# Altium schematic sheet ESP32.SchDoc
size A3; DrawnBy: Orhun Dabak; SheetNumber: 5; SheetTotal: 7
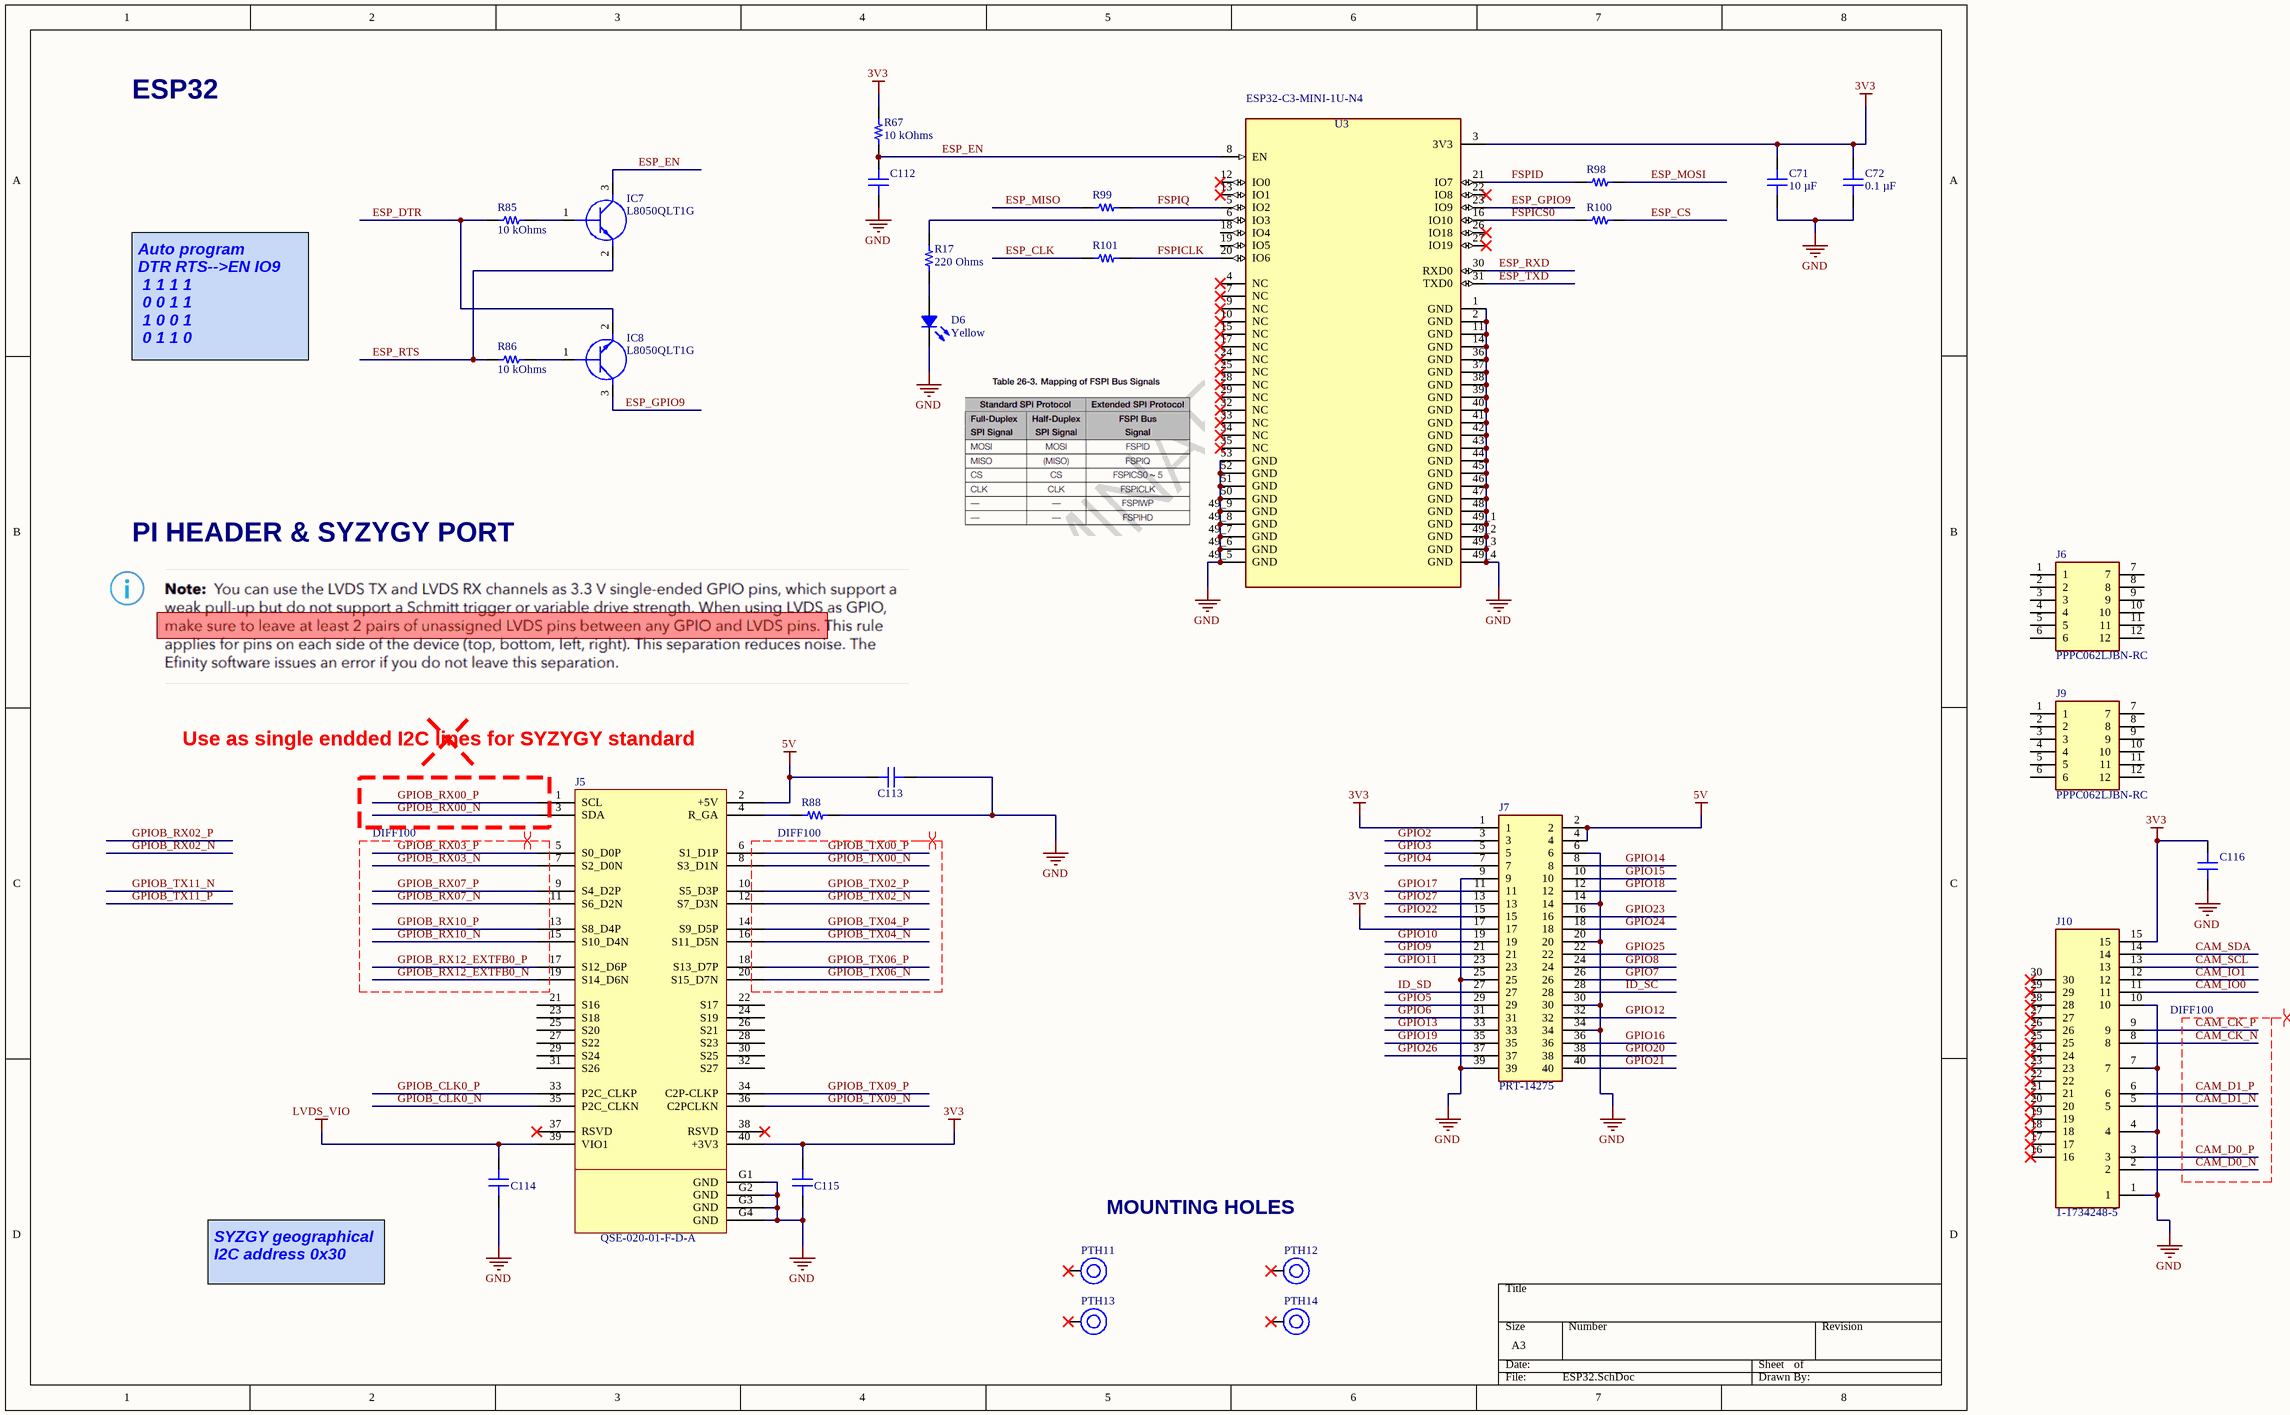
[diagram p0: ESP32.SchDoc]

## Parts
C71  10 µF  [CAP 0603_1608]
C72  0.1 µF  [CAP 0603_1608]
C112  1 µF  [CAP 0402_1005]  (value not drawn)
C113  0.1 µF  [CAP 0402_1005]  (value not drawn)
C114  0.1 µF  [CAP 0402_1005]  (value not drawn)
C115  0.1 µF  [CAP 0402_1005]  (value not drawn)
C116  0.1 µF  [CAP 0402_1005]  (value not drawn)
D6  Yellow  [LED 0603_1608 YELLOW]
IC7  L8050QLT1G  [L8050QLT1G]
IC8  L8050QLT1G  [L8050QLT1G]
J5  QSE-020-01-F-D-A  [QSE-020-01-F-D-A-Footprint-2]
J6  PPPC062LJBN-RC  [RHDRRA12W60P254X254_2X6_1574X850X508P]
J7  PRT-14275  [HDRV40W64P254_2X20_5080X500X884P]
J9  PPPC062LJBN-RC  [RHDRRA12W60P254X254_2X6_1574X850X508P]
J10  1-1734248-5  [117342485]
PTH11  SYZYGY_PCB_Mounting_Hole  [SYZYGY_PCB_Mounting_Hole]  (value not drawn)  (no BOM)
PTH12  SYZYGY_PCB_Mounting_Hole  [SYZYGY_PCB_Mounting_Hole]  (value not drawn)  (no BOM)
PTH13  SYZYGY_PCB_Mounting_Hole  [SYZYGY_PCB_Mounting_Hole]  (value not drawn)  (no BOM)
PTH14  SYZYGY_PCB_Mounting_Hole  [SYZYGY_PCB_Mounting_Hole]  (value not drawn)  (no BOM)
R17  220 Ohms  [RES 0402_1005]
R67  10 kOhms  [RES 0402_1005]
R85  10 kOhms  [RES 0402_1005]
R86  10 kOhms  [RES 0402_1005]
R88  210 kOhms  [RES 0402_1005]  (value not drawn)
R98  33 Ohms  [RES 0402_1005]  (value not drawn)
R99  33 Ohms  [RES 0402_1005]  (value not drawn)
R100  33 Ohms  [RES 0402_1005]  (value not drawn)
R101  33 Ohms  [RES 0402_1005]  (value not drawn)
U3  ESP32-C3-MINI-1U-N4  [XCVR_ESP32-C3-MINI-1U-N4]

## Nets
3V3: C71.2 C72.2 C115.1 C116.2 J5.40(+3V3) J7.1 J7.17 J10.15 R67.2 U3.3(3V3)
5V: C113.2 J5.2(+5V) J7.2 J7.4
GND: C71.1 C72.1 C112.1 C113.1 C114.2 C115.2 C116.1 D6.2 J5.G1(GND) J5.G2(GND) J5.G3(GND) J5.G4(GND) J7.6 J7.9 J7.14 J7.20 J7.25 J7.30 J7.34 J7.39 J10.1 J10.4 J10.7 J10.10 R88.2 U3.1(GND) U3.2(GND) U3.11(GND) U3.14(GND) U3.36(GND) U3.37(GND) U3.38(GND) U3.39(GND) U3.40(GND) U3.41(GND) U3.42(GND) U3.43(GND) U3.44(GND) U3.45(GND) U3.46(GND) U3.47(GND) U3.48(GND) U3.49_1(GND) U3.49_2(GND) U3.49_3(GND) U3.49_4(GND) U3.49_5(GND) U3.49_6(GND) U3.49_7(GND) U3.49_8(GND) U3.49_9(GND) U3.50(GND) U3.51(GND) U3.52(GND) U3.53(GND)
LVDS_VIO: C114.1 J5.39(VIO1)
CAM_CK_N: J10.8
CAM_CK_P: J10.9
CAM_D0_N: J10.2
CAM_D0_P: J10.3
CAM_D1_N: J10.5
CAM_D1_P: J10.6
CAM_IO0: J10.11
CAM_IO1: J10.12
CAM_SCL: J10.13
CAM_SDA: J10.14
ESP_CLK: R101.1
ESP_CS: R100.2
ESP_DTR: IC8.2(E) R85.2
ESP_EN: C112.2 IC7.3(C) R67.1 U3.8(EN)
ESP_GPIO9: IC8.3(C) U3.23(IO9)
ESP_MISO: R99.1
ESP_MOSI: R98.2
ESP_RTS: IC7.2(E) R86.2
ESP_RXD: U3.30(RXD0)
ESP_TXD: U3.31(TXD0)
FSPICLK: R101.2 U3.20(IO6)
FSPICS0: R100.1 U3.16(IO10)
FSPID: R98.1 U3.21(IO7)
FSPIQ: R99.2 U3.5(IO2)
GPIO2: J7.3
GPIO3: J7.5
GPIO4: J7.7
GPIO5: J7.29
GPIO6: J7.31
GPIO7: J7.26
GPIO8: J7.24
GPIO9: J7.21
GPIO10: J7.19
GPIO11: J7.23
GPIO12: J7.32
GPIO13: J7.33
GPIO14: J7.8
GPIO15: J7.10
GPIO16: J7.36
GPIO17: J7.11
GPIO18: J7.12
GPIO19: J7.35
GPIO20: J7.38
GPIO21: J7.40
GPIO22: J7.15
GPIO23: J7.16
GPIO24: J7.18
GPIO25: J7.22
GPIO26: J7.37
GPIO27: J7.13
GPIOB_CLK0_N: J5.35(P2C_CLKN)
GPIOB_CLK0_P: J5.33(P2C_CLKP)
GPIOB_RX00_N: J5.3(SDA)
GPIOB_RX00_P: J5.1(SCL)
GPIOB_RX03_N: J5.7(S2_D0N)
GPIOB_RX03_P: J5.5(S0_D0P)
GPIOB_RX07_N: J5.11(S6_D2N)
GPIOB_RX07_P: J5.9(S4_D2P)
GPIOB_RX10_N: J5.15(S10_D4N)
GPIOB_RX10_P: J5.13(S8_D4P)
GPIOB_RX12_EXTFB0_N: J5.19(S14_D6N)
GPIOB_RX12_EXTFB0_P: J5.17(S12_D6P)
GPIOB_TX00_N: J5.8(S3_D1N)
GPIOB_TX00_P: J5.6(S1_D1P)
GPIOB_TX02_N: J5.12(S7_D3N)
GPIOB_TX02_P: J5.10(S5_D3P)
GPIOB_TX04_N: J5.16(S11_D5N)
GPIOB_TX04_P: J5.14(S9_D5P)
GPIOB_TX06_N: J5.20(S15_D7N)
GPIOB_TX06_P: J5.18(S13_D7P)
GPIOB_TX09_N: J5.36(C2PCLKN)
GPIOB_TX09_P: J5.34(C2P-CLKP)
ID_SC: J7.28
ID_SD: J7.27
NetD6_1: D6.1 R17.2
NetIC7_1: IC7.1(B) R85.1
NetIC8_1: IC8.1(B) R86.1
NetJ5_4: J5.4(R_GA) R88.1
NetR17_1: R17.1 U3.6(IO3)

Not connected (* = marked no-connect by the designer): J5 21(S16) 22(S17) 23(S18) 24(S19) 25(S20) 26(S21) 27(S22) 28(S23) 29(S24) 30(S25) 31(S26) 32(S27) 37(RSVD)* 38(RSVD)*; J6 1 2 3 4 5 6 7 8 9 10 11 12; J9 1 2 3 4 5 6 7 8 9 10 11 12; J10 16* 17* 18* 19* 20* 21* 22* 23* 24* 25* 26* 27* 28* 29* 30*; PTH11 1*; PTH12 1*; PTH13 1*; PTH14 1*; U3 4(NC)* 7(NC)* 9(NC)* 10(NC)* 12(IO0)* 13(IO1)* 15(NC)* 17(NC)* 18(IO4) 19(IO5) 22(IO8)* 24(NC)* 25(NC)* 26(IO18)* 27(IO19)* 28(NC)* 29(NC)* 32(NC)* 33(NC)* 34(NC)* 35(NC)*

## Layout directives
differential pair; differential pair class DIFF100: CAM_CK_N, CAM_CK_P, CAM_D0_N, CAM_D0_P, CAM_D1_N, CAM_D1_P, GPIOB_RX03_N, GPIOB_RX03_P, GPIOB_RX07_N, GPIOB_RX07_P, GPIOB_RX10_N, GPIOB_RX10_P, GPIOB_RX12_EXTFB0_N, GPIOB_RX12_EXTFB0_P, GPIOB_TX00_N, GPIOB_TX00_P, GPIOB_TX02_N, GPIOB_TX02_P, GPIOB_TX04_N, GPIOB_TX04_P, GPIOB_TX06_N, GPIOB_TX06_P

## Notes on the sheet
- ESP32
- Auto program
  DTR RTS-->EN IO9
  1 1 1 1
  0 0 1 1
  1 0 0 1
  0 1 1 0
- PI HEADER & SYZYGY PORT
- Use as single endded I2C lines for SYZYGY standard
- MOUNTING HOLES
- SYZGY geographical I2C address 0x30

## Library data of the parts
C71 = GRM188R60J106ME47D: CAP CER 10UF 6.3V X5R 0603; manufacturer: Murata Electronics; Tolerance: ±20%; Part Number: GRM188R60J106ME47D; Value: 10 µF; Applications: General Purpose; Capacitance: 10 µF; componentlink1description: Datasheet; componentlink1url: https://www.murata.com/~/media/webrenewal/support/library/catalog/products/capacitor/mlcc/c02e.ashx?la=en-us; componentlink2description: DigiKey Link; componentlink2url: https://www.digikey.com/en/products/detail/murata-electronics/GRM188R60J106ME47D/965910; Device Package: 0603 (1608 Metric); lastupdated: 9/19/2022 01:01:20 PM; Lifecycle Status: Active; Minimum Order: 1; Mounting Type: Surface Mount, MLCC; Operating Temperature: -55°C ~ 85°C; Package / Case: 0603 (1608 Metric); packaging: TapeAndReel; partid: 2351; Part Status: Active; price: 0.02; series: GRM; Size / Dimension: 0.063" L x 0.031" W (1.60mm x 0.80mm); Supplier 1: DigiKey; Supplier Part Number 1: 490-3896-1-ND; Temperature Coefficient: X5R; Thickness (Max): 0.035" (0.90mm); Voltage - Rated: 6.3V
C72 = 6R3X14W104MV4T: CAP CER 0.1UF 6.3V X7R 0603; manufacturer: Johanson Dielectrics Inc.; Tolerance: ±20%; Part Number: 6R3X14W104MV4T; Value: 0.1 µF; Applications: Bypass, Decoupling; Capacitance: 0.1 µF; componentlink1description: Datasheet; componentlink1url: https://www.johansondielectrics.com/downloads/x2y-filter-and-decoupling-capacitors.pdf; componentlink2description: DigiKey Link; componentlink2url: https://www.digikey.com/en/products/detail/johanson-dielectrics-inc/6R3X14W104MV4T/1556331; Device Package: 0603 (1608 Metric); Features: Low ESL (X2Y); lastupdated: 9/19/2022 01:01:19 PM; Lifecycle Status: Active; Minimum Order: 1; Mounting Type: Surface Mount, MLCC; Operating Temperature: -55°C ~ 125°C; Package / Case: 0603 (1608 Metric); packaging: TapeAndReel; partid: 2650; Part Status: Active; price: 0.08; series: X2Y®; Size / Dimension: 0.064" L x 0.035" W (1.63mm x 0.89mm); Supplier 1: DigiKey; Supplier Part Number 1: 709-1009-1-ND; Temperature Coefficient: X7R; Thickness (Max): 0.026" (0.66mm); Voltage - Rated: 6.3V
C112 = GRM155R70J105KA12J: CAP CER 1UF 6.3V X7R 0402; manufacturer: Murata Electronics; Tolerance: ±10%; Part Number: GRM155R70J105KA12J; Value: 1 µF; Applications: General Purpose; Capacitance: 1 µF; componentlink1description: Datasheet; componentlink1url: https://search.murata.co.jp/Ceramy/image/img/A01X/G101/ENG/GRM155R70J105KA12-01.pdf; componentlink2description: DigiKey Link; componentlink2url: https://www.digikey.com/en/products/detail/murata-electronics/GRM155R70J105KA12J/4905166; Device Package: 0402 (1005 Metric); lastupdated: 19/09/2022 12:57:31; Lifecycle Status: Active; Minimum Order: 1; Mounting Type: Surface Mount, MLCC; Operating Temperature: -55°C ~ 125°C; Package / Case: 0402 (1005 Metric); packaging: TapeAndReel; partid: 2890; Part Status: Active; price: 0.01; series: GRM; Size / Dimension: 0.039" L x 0.020" W (1.00mm x 0.50mm); Supplier 1: DigiKey; Supplier Part Number 1: 490-13339-1-ND; Temperature Coefficient: X7R; Thickness (Max): 0.022" (0.55mm); Voltage - Rated: 6.3V
C113-C116 = CC0402KRX7R6BB104: CAP CER 0.1UF 10V X7R 0402; manufacturer: Yageo; Tolerance: ±10%; Part Number: CC0402KRX7R6BB104; Value: 0.1 µF; Applications: General Purpose; Capacitance: 0.1 µF; componentlink1description: Datasheet; componentlink1url: https://www.yageo.com/upload/media/product/productsearch/datasheet/mlcc/UPY-GPHC_X7R_6.3V-to-50V_18.pdf; componentlink2description: DigiKey Link; componentlink2url: https://www.digikey.com/en/products/detail/yageo/CC0402KRX7R6BB104/2103083; Device Package: 0402 (1005 Metric); lastupdated: 19/09/2022 12:57:28; Lifecycle Status: Active; Minimum Order: 1; Mounting Type: Surface Mount, MLCC; Operating Temperature: -55°C ~ 125°C; Package / Case: 0402 (1005 Metric); packaging: CutTape; partid: 3877; Part Status: Active; price: 0.01; series: CC; Size / Dimension: 0.039" L x 0.020" W (1.00mm x 0.50mm); Supplier 1: DigiKey; Supplier Part Number 1: 311-1345-1-ND; Temperature Coefficient: X7R; Thickness (Max): 0.022" (0.55mm); Voltage - Rated: 10V
D6 = SML-LX0603YW-TR: LED YELLOW DIFFUSED SMD; Manufacturer: Lumex Opto/Components Inc.; Configuration: Standard; Current - Test: 20mA; Lens Color: White; Lens Size: 1.00mm x 0.80mm; Lens Style: Rectangle with Flat Top; Millicandela Rating: 14mcd; Viewing Angle: 160°; Voltage - Forward (Vf) (Typ): 2.1V; Wavelength - Peak: 585nm; Part Number: SML-LX0603YW-TR; Color: Yellow; ComponentLink1Description: Datasheet; ComponentLink1URL: https://www.lumex.com/content/files/ProductAttachment/SML-LX0603YW-TR.pdf; ComponentLink2Description: DigiKey Link; ComponentLink2URL: https://www.digikey.com/en/products/detail/lumex-opto-components-inc/SML-LX0603YW-TR/304361; Device Package: 0603 (1608 Metric); Height (Max): 0.60mm; LastUpdated: 19/09/2022 13:51:05; Lens Transparency: Diffused; Lifecycle Status: Active; Minimum Order: 1; Mounting Type: Surface Mount; Package / Case: 0603 (1608 Metric); Packaging: TapeAndReel; PartId: 92; Part Status: Active; Price: 0.05; Series: -; Size / Dimension: 1.60mm L x 0.80mm W; Supplier 1: DigiKey; Supplier Part Number 1: 67-1550-1-ND; Value: Yellow
IC7 IC8 = L8050QLT1G: Integrated Circuit; Manufacturer_Name: Leshan Radio; Datasheet Link: https://datasheet.datasheetarchive.com/originals/distributors/Datasheets-28/DSA-558356.pdf; Height: 1.11mm; Manufacturer_Part_Number: L8050QLT1G
J5 = CMP-002-00073-2_2: Conn High Speed Socket Strip SKT 40 POS 0.8mm Solder ST SMD Tray
J6 J9 = PPPC062LJBN-RC: Connector; Manufacturer_Name: Sullins; Datasheet Link: https://drawings-pdf.s3.amazonaws.com/10494.pdf; Height: 5.08mm; Manufacturer_Part_Number: PPPC062LJBN-RC
J7 = PRT-14275: Connector; Manufacturer_Name: SparkFun; Datasheet Link: https://componentsearchengine.com/Datasheets/1/PRT-14275.pdf; Height: 8.84mm; Manufacturer_Part_Number: PRT-14275; Mouser Part Number: 474-PRT-14275; Mouser Price/Stock: https://www.mouser.co.uk/ProductDetail/SparkFun/PRT-14275?qs=YCa%2FAAYMW01SLG%2FRsDUFug%3D%3D; Arrow Part Number: PRT-14275; Arrow Price/Stock: https://www.arrow.com/en/products/prt-14275/sparkfun-electronics?region=nac
J10 = 1-1734248-5: Connector; Manufacturer_Name: TE Connectivity; Datasheet Link: https://www.te.com/commerce/DocumentDelivery/DDEController?Action=showdoc&DocId=Customer+Drawing%7F1734248%7FE1%7Fpdf%7FEnglish%7FENG_CD_1734248_E1__.pdf%7F1-1734248-5; Height: 7.7mm; Manufacturer_Part_Number: 1-1734248-5; Mouser Part Number: 571-1-1734248-5; Mouser Price/Stock: https://www.mouser.co.uk/ProductDetail/TE-Connectivity/1-1734248-5?qs=GQ3BsEl46pkrMd7Fg9TUQQ%3D%3D; Arrow Part Number: 1-1734248-5; Arrow Price/Stock: https://www.arrow.com/en/products/1-1734248-5/te-connectivity?region=nac
R17 = RC0402FR-07220RL: RES 220 OHM 1% 1/16W 0402; Manufacturer: Yageo; Power (Watts): 0.063W, 1/16W; Temperature Coefficient: ±100ppm/°C; Part Number: RC0402FR-07220RL; Value: 220 Ohms; ComponentLink1Description: Datasheet; ComponentLink1URL: https://www.yageo.com/upload/media/product/productsearch/datasheet/rchip/PYu-RC_Group_51_RoHS_L_10.pdf; ComponentLink2Description: DigiKey Link; ComponentLink2URL: https://www.digikey.com/en/products/detail/yageo/RC0402FR-07220RL/726565; Composition: Thick Film; Device Package: 0402 (1005 Metric); Features: Moisture Resistant; Height - Seated (Max): 0.016" (0.40mm); LastUpdated: 19/09/2022 13:14:14; Lifecycle Status: Active; Minimum Order: 1; Number of Terminations: 2; Operating Temperature: -55°C ~ 155°C; Package / Case: 0402 (1005 Metric); Packaging: CutTape; PartId: 17956; Part Status: Active; Price: 0.01; Resistance: 220 Ohms; Series: RC_L; Size / Dimension: 0.039" L x 0.020" W (1.00mm x 0.50mm); Supplier 1: DigiKey; Supplier Part Number 1: 311-220LRCT-ND; Supplier Device Package: 0402; Tolerance: ±1%
R67 R85 R86 = RP73PF1E10KBTD: RES 10K OHM 0.1% 1/10W 0402; Manufacturer: TE Connectivity Passive Product; Power (Watts): 0.1W, 1/10W; Temperature Coefficient: ±25ppm/°C; Part Number: RP73PF1E10KBTD; Value: 10 kOhms; ComponentLink1Description: Datasheet; ComponentLink1URL: https://www.te.com/commerce/DocumentDelivery/DDEController?Action=srchrtrv&DocNm=1773272&DocType=DS&DocLang=English; ComponentLink2Description: DigiKey Link; ComponentLink2URL: https://www.digikey.com/en/products/detail/te-connectivity-passive-product/RP73PF1E10KBTD/8260957; Composition: Thin Film; Device Package: 0402 (1005 Metric); Height - Seated (Max): 0.014" (0.35mm); LastUpdated: 9/19/2022 01:15:04 PM; Lifecycle Status: Active; Minimum Order: 1; Number of Terminations: 2; Operating Temperature: -55°C ~ 155°C; Package / Case: 0402 (1005 Metric); Packaging: TapeAndReel; PartId: 2434; Part Status: Active; Price: 0.09; Resistance: 10 kOhms; Series: RP73, Holsworthy; Size / Dimension: 0.039" L x 0.020" W (1.00mm x 0.50mm); Supplier 1: DigiKey; Supplier Part Number 1: A127415CT-ND; Supplier Device Package: 0402; Tolerance: ±0.1%
R88 = RC0402FR-07210KL: RES 210K OHM 1% 1/16W 0402; Manufacturer: Yageo; Power (Watts): 0.063W, 1/16W; Temperature Coefficient: ±100ppm/°C; Part Number: RC0402FR-07210KL; Value: 210 kOhms; ComponentLink1Description: Datasheet; ComponentLink1URL: https://www.yageo.com/upload/media/product/productsearch/datasheet/rchip/PYu-RC_Group_51_RoHS_L_10.pdf; ComponentLink2Description: DigiKey Link; ComponentLink2URL: https://www.digikey.com/en/products/detail/yageo/RC0402FR-07210KL/726560; Composition: Thick Film; Device Package: 0402 (1005 Metric); Features: Moisture Resistant; Height - Seated (Max): 0.016" (0.40mm); LastUpdated: 19/09/2022 13:14:10; Lifecycle Status: Active; Minimum Order: 1; Number of Terminations: 2; Operating Temperature: -55°C ~ 155°C; Package / Case: 0402 (1005 Metric); Packaging: CutTape; PartId: 19115; Part Status: Active; Price: 0.01; Resistance: 210 kOhms; Series: RC_L; Size / Dimension: 0.039" L x 0.020" W (1.00mm x 0.50mm); Supplier 1: DigiKey; Supplier Part Number 1: 311-210KLRCT-ND; Supplier Device Package: 0402; Tolerance: ±1%
R98-R101 = RC0402FR-0733RL: RES 33 OHM 1% 1/16W 0402; Manufacturer: Yageo; Power (Watts): 0.063W, 1/16W; Temperature Coefficient: ±100ppm/°C; Part Number: RC0402FR-0733RL; Value: 33 Ohms; ComponentLink1Description: Datasheet; ComponentLink1URL: https://www.yageo.com/upload/media/product/productsearch/datasheet/rchip/PYu-RC_Group_51_RoHS_L_10.pdf; ComponentLink2Description: DigiKey Link; ComponentLink2URL: https://www.digikey.com/en/products/detail/yageo/RC0402FR-0733RL/726593; Composition: Thick Film; Device Package: 0402 (1005 Metric); Features: Moisture Resistant; Height - Seated (Max): 0.016" (0.40mm); LastUpdated: 19/09/2022 13:14:04; Lifecycle Status: Active; Minimum Order: 1; Number of Terminations: 2; Operating Temperature: -55°C ~ 155°C; Package / Case: 0402 (1005 Metric); Packaging: CutTape; PartId: 20555; Part Status: Active; Price: 0.01; Resistance: 33 Ohms; Series: RC_L; Size / Dimension: 0.039" L x 0.020" W (1.00mm x 0.50mm); Supplier 1: DigiKey; Supplier Part Number 1: 311-33.0LRCT-ND; Supplier Device Package: 0402; Tolerance: ±1%
U3 = ESP32-C3-MINI-1U-N4: Bluetooth, WiFi 802.11b/g/n, Bluetooth v5.0 Transceiver Module 2.412GHz ~ 2.484GHz Antenna Not Included, I-PEX Surface Mount; MF: Espressif Systems; SnapEDA_Link: https://www.snapeda.com/parts/ESP32-C3-MINI-1U-N4/Espressif+Systems/view-part/?ref=snap; Check_prices: https://www.snapeda.com/parts/ESP32-C3-MINI-1U-N4/Espressif+Systems/view-part/?ref=eda; Digi-Key_Part_Number: 1965-ESP32-C3-MINI-1U-N4TR-ND; Package: None; Purchase-URL: https://pricing.snapeda.com/search/part/ESP32-C3-MINI-1U-N4/?ref=eda; Value: *; MP: ESP32-C3-MINI-1U-N4